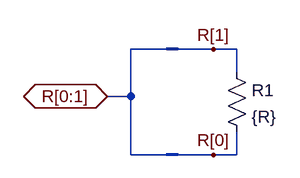
[diagram p0: schematic bus_term.asc]
bus_term.asc, the LTspice schematic file:
Version 4
SHEET 1 880 680
WIRE -16 112 -64 112
WIRE 48 112 0 112
WIRE 80 112 48 112
WIRE 80 144 80 112
WIRE -64 176 -64 112
WIRE -64 176 -96 176
WIRE -64 256 -64 176
WIRE -16 256 -64 256
WIRE 48 256 0 256
WIRE 80 256 80 224
WIRE 80 256 48 256
FLAG -96 176 R[0:1]
IOPIN -96 176 BiDir
FLAG 48 256 R[0]
FLAG 48 112 R[1]
BUSTAP 0 112 -16 112
BUSTAP 0 256 -16 256
SYMBOL res 64 128 R0
SYMATTR InstName R1
SYMATTR Value {R}

The netlist it stands for:
* bus_term.asc
R1 R[1] R[0] {R}
.backanno
.end